# Altium project Altium PCB Design.PrjPcb
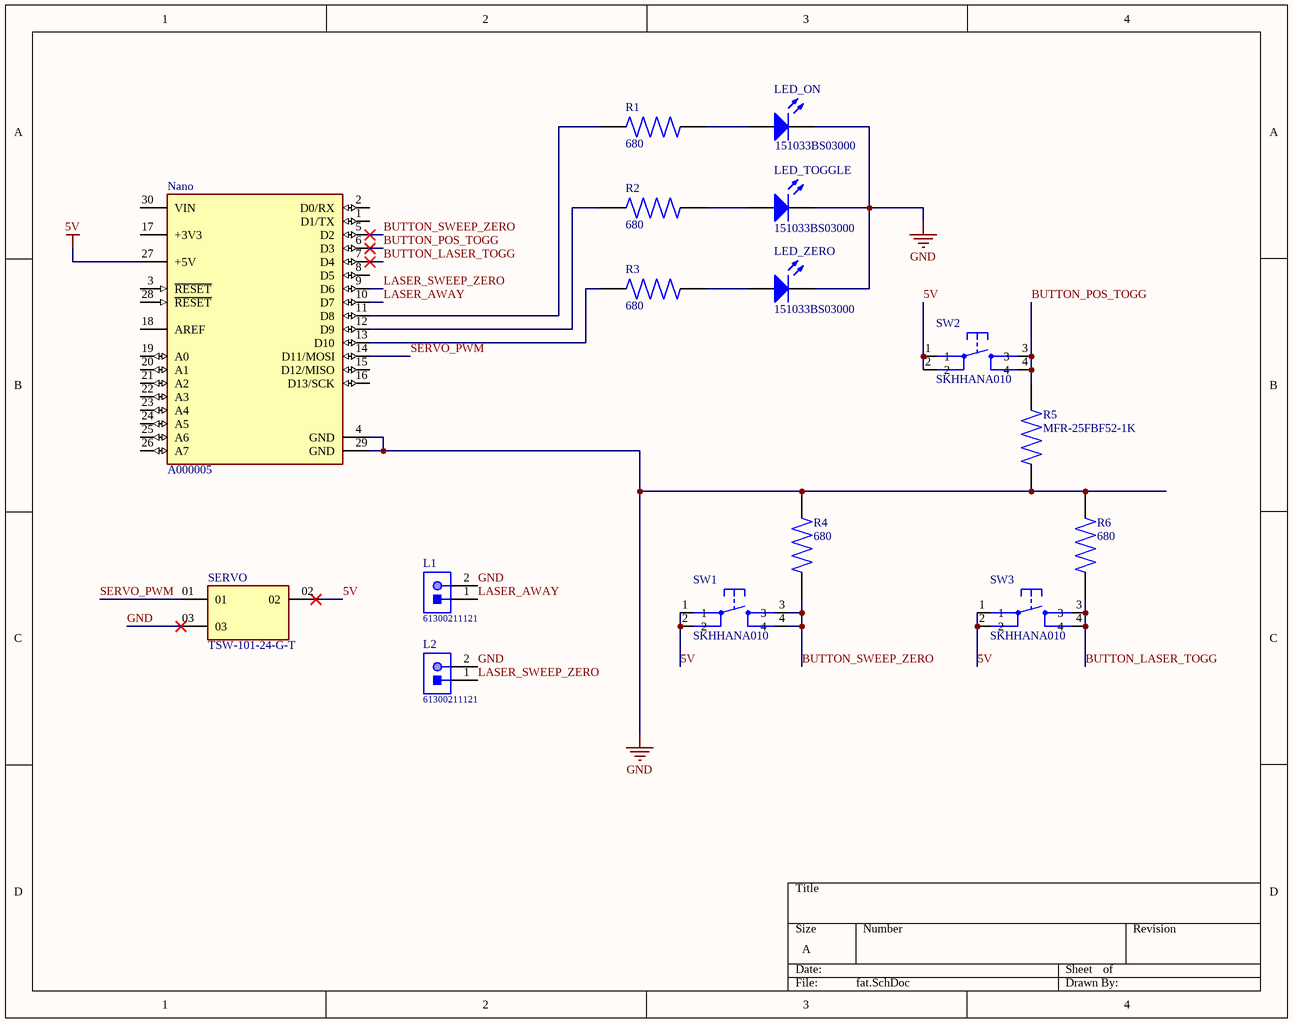
[diagram p0: fat.SchDoc]
1 sheet, 16 parts. Net scope: global (net labels, ports and power ports of the same name join across sheets).
Board file: fat.PcbDoc

## Sheet fat.SchDoc
size A; SheetNumber: 1; SheetTotal: 1

### Parts
L1  61300211121  [61300211121]
L2  61300211121  [61300211121]
LED_ON  151033BS03000  [Type 3mm]
LED_TOGGLE  151033BS03000  [Type 3mm]
LED_ZERO  151033BS03000  [Type 3mm]
Nano  A000005  [FP-A000005-MFG]
R1  680  [RESAD1100W55L680D260]
R2  680  [RESAD1100W55L680D260]
R3  680  [RESAD1100W55L680D260]
R4  680  [RESAD1100W55L680D260]
R5  MFR-25FBF52-1K  [RESAD1100W55L680D260]
R6  680  [RESAD1100W55L680D260]
SERVO  TSW-101-24-G-T  [SAMTEC_TSW-101-24-G-T]
SW1  SKHHANA010  [SW_SKHHANA010]
SW2  SKHHANA010  [SW_SKHHANA010]
SW3  SKHHANA010  [SW_SKHHANA010]

### Nets
5V: Nano.27(+5V) SERVO.02 SW1.1 SW1.2 SW2.1 SW2.2 SW3.1 SW3.2
GND: L1.2 L2.2 LED_ON.1(K) LED_TOGGLE.1(K) LED_ZERO.1(K) Nano.4(GND) Nano.29(GND) R4.1 R5.2 R6.1 SERVO.03
BUTTON_LASER_TOGG: Nano.7(D4) R6.2 SW3.3 SW3.4
BUTTON_POS_TOGG: Nano.6(D3) R5.1 SW2.3 SW2.4
BUTTON_SWEEP_ZERO: Nano.5(D2) R4.2 SW1.3 SW1.4
LASER_AWAY: L1.1 Nano.10(D7)
LASER_SWEEP_ZERO: L2.1 Nano.9(D6)
SERVO_PWM: Nano.14(D11/MOSI) SERVO.01
NetLED_ON_2: LED_ON.2(A) R1.2
NetLED_TOGGLE_2: LED_TOGGLE.2(A) R2.2
NetLED_ZERO_2: LED_ZERO.2(A) R3.2
NetNano_11: Nano.11(D8) R1.1
NetNano_12: Nano.12(D9) R2.1
NetNano_13: Nano.13(D10) R3.1

Not connected (* = marked no-connect by the designer): Nano 1(D1/TX) 2(D0/RX) 3(~{RESET}) 8(D5) 15(D12/MISO) 16(D13/SCK) 17(+3V3) 18(AREF) 19(A0) 20(A1) 21(A2) 22(A3) 23(A4) 24(A5) 25(A6) 26(A7) 28(~{RESET}) 30(VIN)

### Library data of the parts
L1 L2 = CMP-1712-00002-4: THT Vertical Pin Header WR-PHD, Pitch 2.54 mm, Single Row, 2 pins; Manufacturer: Wurth Elektronik; Rated Current: 3A; Gender: Male; Withstanding Voltage: 500VAC; Working Voltage: 250VAC; Pitch: 2.54mm; Contact Resistance: 20mOhm; Pin Number: 2; Mounting Technology: THT; Orientation: Vertical; Operating Temperature: -40to105degC; Packaging: Bag; Publisher: WurthElektronik; Datasheet URL: https://katalog.we-online.de/em/datasheet/6130xx11121.pdf; Manufacturer URL: http://www.we-online.de; Row Number: Single; Package Reference: 61300211121; Part Number: 61300211121
LED_ON LED_TOGGLE LED_ZERO = CMP-1489-00002-1: THT LED round mono-color waterclear, WL-TMRW , Blue; Manufacturer: Wuerth Elektronik; ComponentLink2URL: http://katalog.we-online.de/pbs/datasheet/7448042001.pdfhttp://katalog.we-online.de/pbs/datasheet/7448042001.pdfhttp://katalog.we-online.de/pbs/datasheet/7448042001.pdfhttp://katalog.we-online.de/pbs/datasheet/151033BS03000.pdf; ComponentLink1Description: Manufacturer URL; Emitting color: Blue; PackageReference: Type 3mm; ComponentLink2Description: Datasheet; PartNumber: 151033BS03000; ComponentLink1URL: http://www.we-online.com
Nano = CMP-189986-000002-1: ARDUINO NANO ATMEGA328 EVAL BRD; Number of Bits: 8; Evaluation Kit: Yes; Operating Supply Voltage: 12V; Interface: I2C; Data Bus Width: 8b; Core Architecture: AVR; Packaging: Bulk; Length: 7inch; Package Quantity: 50; Width: 5inch; REACH SVHC: No SVHC; Weight: 0.358383oz; Series: AVR® ATmega; Height: 0.25inch
R1-R6 = MFR-25FBF52-1K: 1.07 kOhms Â±1% 0.25W, 1/4W Through Hole Resistor Axial - Metal Film; MF: Yageo; Value: *; SnapEDA_Link: https://www.snapeda.com/parts/MFR-25FBF52-1K/Yageo/view-part/?ref=snap; Purchase-URL: https://pricing.snapeda.com/search/part/MFR-25FBF52-1K/?ref=eda; Availability: In Stock; Price: None; Package: Axial Yageo; Check_prices: https://www.snapeda.com/parts/MFR-25FBF52-1K/Yageo/view-part/?ref=eda; MP: MFR-25FBF52-1K
SERVO = TSW-101-24-G-T: Connector Header Through Hole 3 position -; MF: Samtec; Value: *; SnapEDA_Link: https://www.snapeda.com/parts/TSW-101-24-G-T/Samtec/view-part/?ref=snap; Purchase-URL: https://pricing.snapeda.com/search/part/TSW-101-24-G-T/?ref=eda; Availability: In Stock; Price: None; Package: None; Check_prices: https://www.snapeda.com/parts/TSW-101-24-G-T/Samtec/view-part/?ref=eda; MP: TSW-101-24-G-T
SW1-SW3 = SKHHANA010: Switch Tactile N.O. SPST Round Button PC Pins 0.05A 12VDC 0.98N Thru-Hole Bulk; MF: ALPS; Value: *; SnapEDA_Link: https://www.snapeda.com/parts/SKHHANA010/ALPS/view-part/248805/?ref=snap; Price: None; Availability: Unavailable; Package: None; MP: SKHHANA010